# Altium schematic sheet lan8710_board.SchDoc: Наименование
size 420 x 297 mm; ApprovedBy: Утвердил; CheckedBy: Проверил; Author: Разработал; CompanyName: Организация; SheetNumber: 1; SheetTotal: 1; PageSetup: Record=PageOptions|CenterHorizontal=True|CenterVertical=True|PrintScale=0.94|XCorrection=1.00|YCorrection=1.00|PrintKind=1|BorderSize=5000000|LeftOffset=0|BottomOffset=0|Orientation=1|PaperLength=1000|PaperWidth=1000|Scale=100|PaperSource=7|PrintQuality=-4|MediaType=1|DitherType=10|PaperKind=A4|PrintScaleMode=1; HeadOfSector: Нач. сектора; MainDevice: Перв.примен.; Name1: Наименование1; n_kontr: Н. Контр; t_kontr: Т. Контр; lit_A: О; Name2: Наименование2; DocumentName: Sheet1.SCHDOC
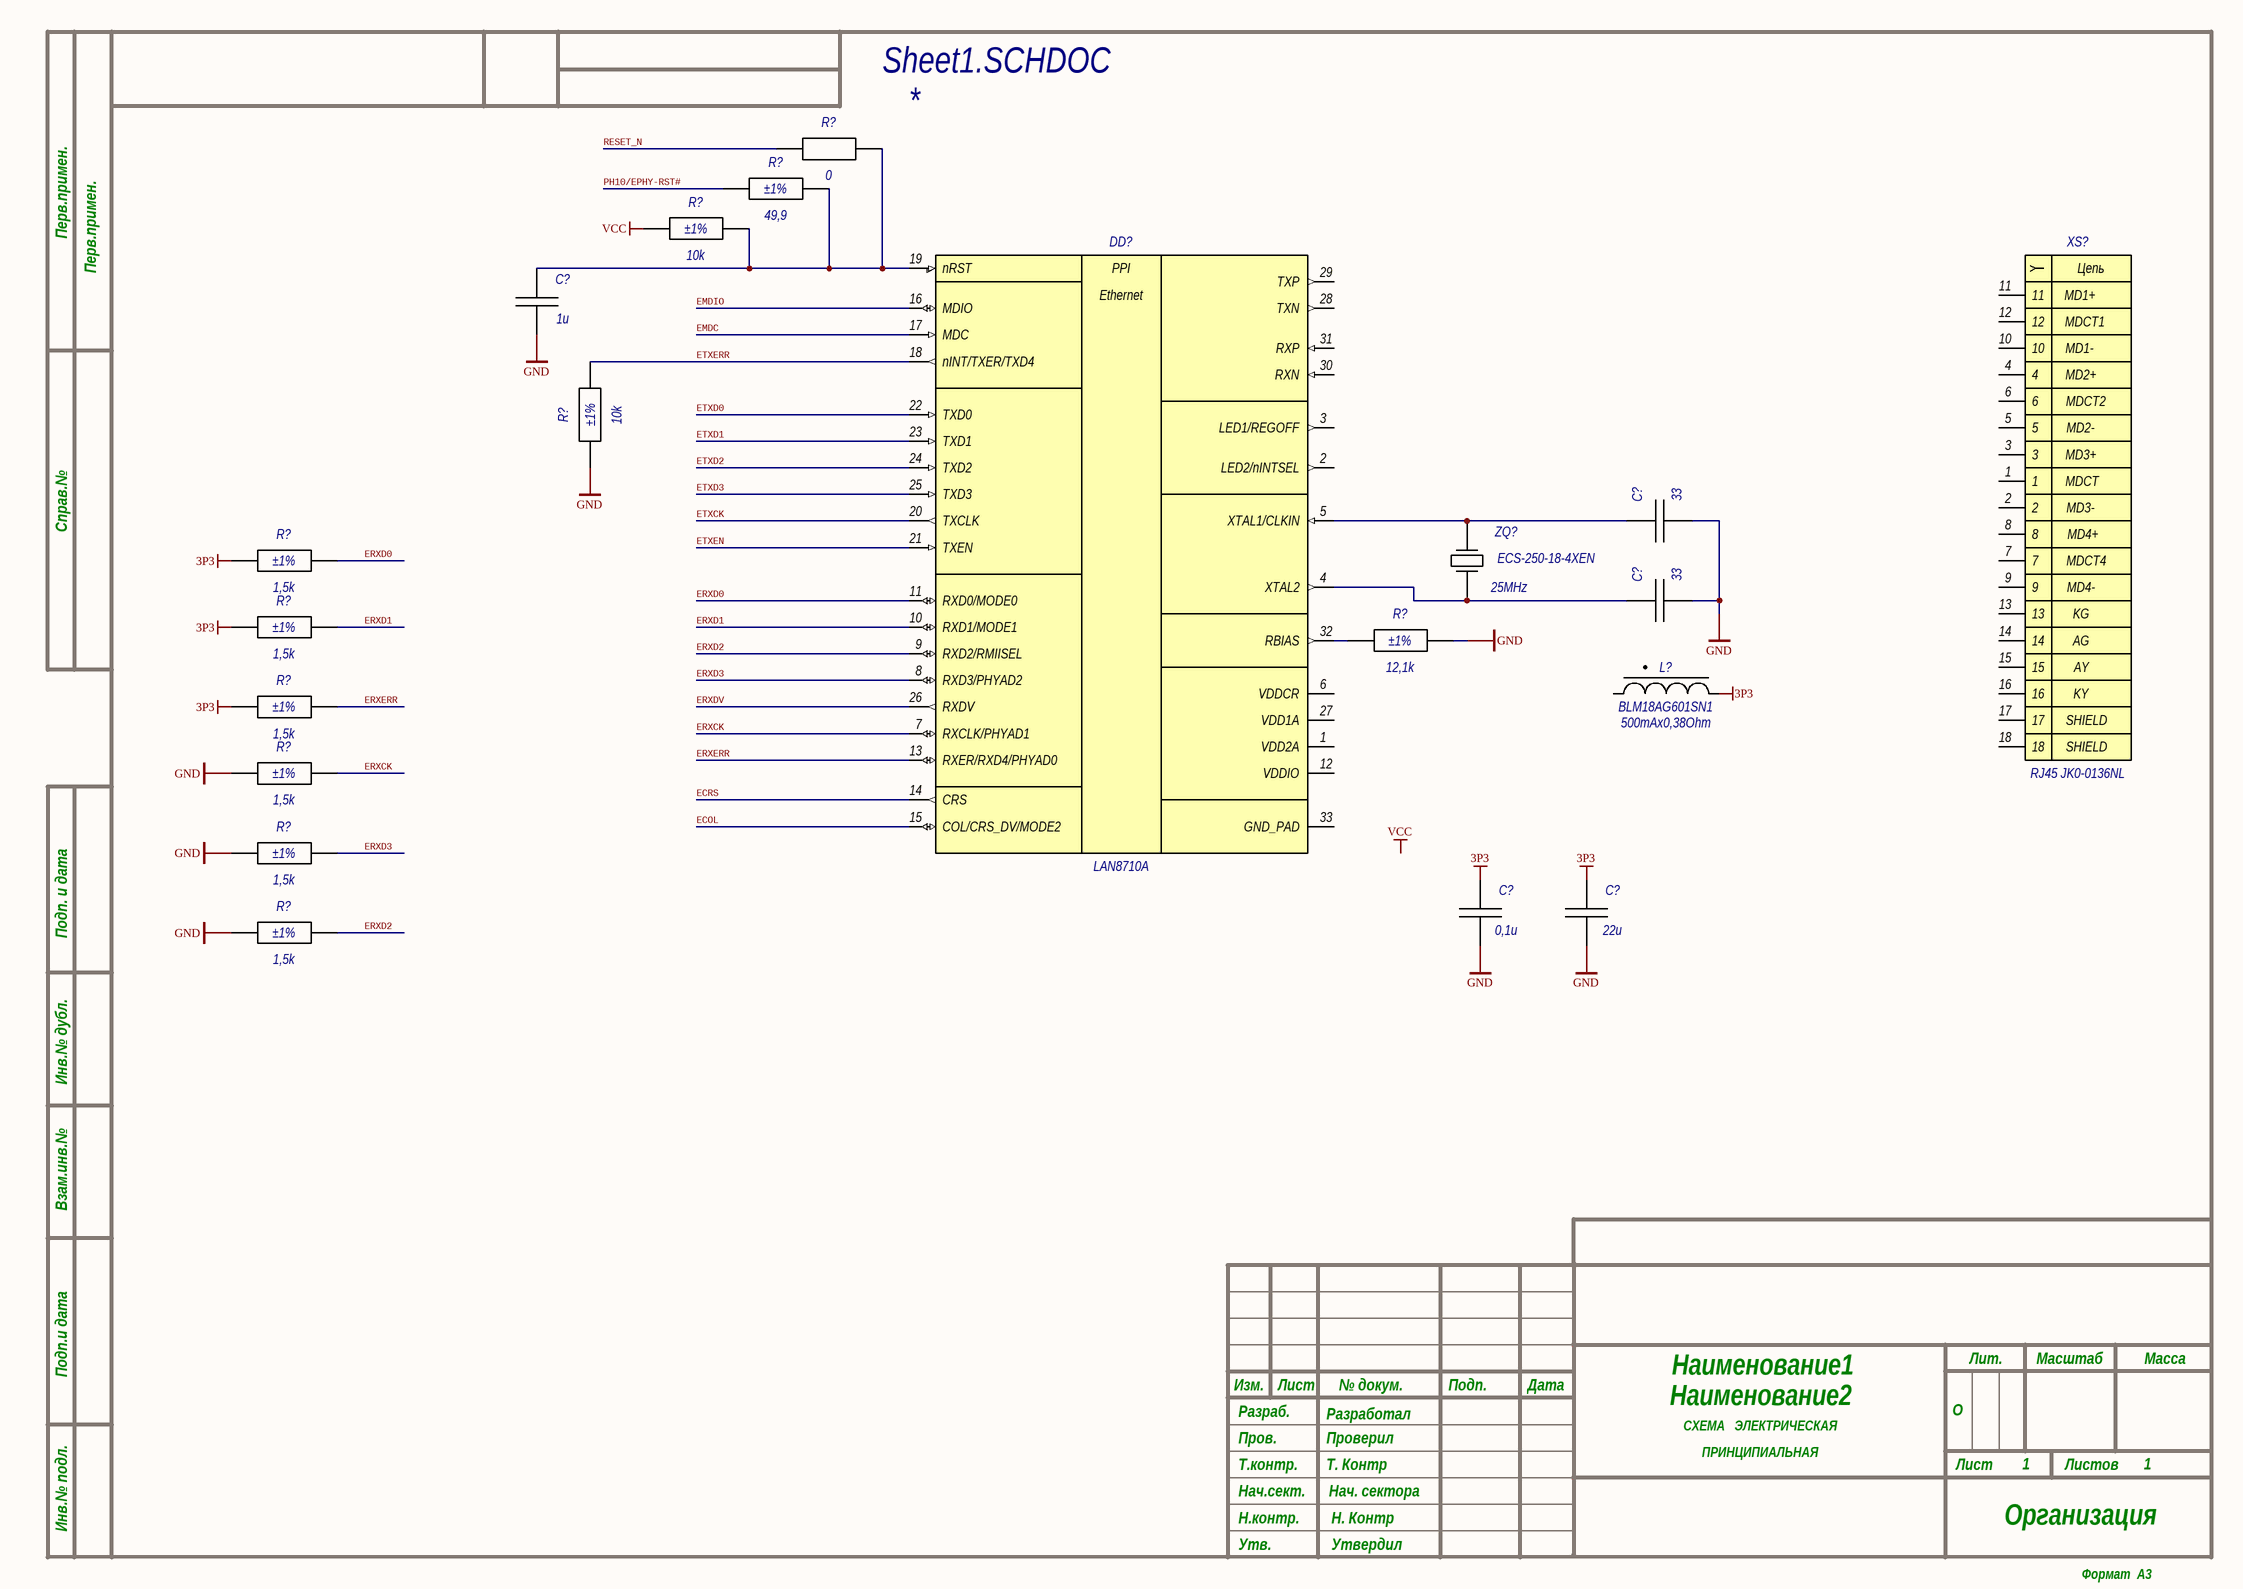
[diagram p0: lan8710_board.SchDoc]

## Parts
(Parts that share a designator on the sheet are numbered #1, #2 ... from top to bottom, then left to right.)
C?#1  1u  [C0603 HD]
C?#2  33  [C0603 HD]
C?#3  33  [C0603 HD]
C?#4  0,1u  [C0603 HD]
C?#5  22u  [C1206 HD]
DD?  LAN8710A  [QFN-32 LAN8710A MD]
L?  SchematicAdditionalParameter1: 500mAx0,38Ohm  [L0603 BLM18A (Murata) HD]  (hidden comment: BLM18AG601SN1)
R?#1  0  [R0603 0 5% HD]
R?#2  SchematicAdditionalParameter1: ±1%  [R0603 1% HD]  (hidden comment: 49,9)
R?#3  SchematicAdditionalParameter1: ±1%  [R0603 10k 1% HD]  (hidden comment: 10k)
R?#4  SchematicAdditionalParameter1: ±1%  [R0603 10k 1% HD]  (hidden comment: 10k)
R?#5  SchematicAdditionalParameter1: ±1%  [R0603 1.5k 1% HD]  (hidden comment: 1,5k)
R?#6  SchematicAdditionalParameter1: ±1%  [R0603 1.5k 1% HD]  (hidden comment: 1,5k)
R?#7  SchematicAdditionalParameter1: ±1%  [R0603 12.1k 1% HD]  (hidden comment: 12,1k)
R?#8  SchematicAdditionalParameter1: ±1%  [R0603 1.5k 1% HD]  (hidden comment: 1,5k)
R?#9  SchematicAdditionalParameter1: ±1%  [R0603 1.5k 1% HD]  (hidden comment: 1,5k)
R?#10  SchematicAdditionalParameter1: ±1%  [R0603 1.5k 1% HD]  (hidden comment: 1,5k)
R?#11  SchematicAdditionalParameter1: ±1%  [R0603 1.5k 1% HD]  (hidden comment: 1,5k)
XS?  RJ45 JK0-0136NL  [RJ45 JK0-0136NL (Pulse)]
ZQ?  SchematicAdditionalParameter2: 25MHz  [ECS-250-18-4XEN (ECS Inc)]  (hidden comment: ECS-250-18-4XEN)

## Nets
3P3: C?#4.1 C?#5.1 L?.2 R?#5.1 R?#6.1 R?#8.1
GND: C?#1.2 C?#2.2 C?#3.2 C?#4.2 C?#5.2 R?#4.1 R?#7.2 R?#9.1 R?#10.1 R?#11.1
VCC: R?#3.1
ECOL: DD?.15(COL/CRS_DV/MODE2)
ECRS: DD?.14(CRS)
EMDC: DD?.17(MDC)
EMDIO: DD?.16(MDIO)
ERXCK: DD?.7(RXCLK/PHYAD1) R?#9.2
ERXD0: DD?.11(RXD0/MODE0) R?#5.2
ERXD1: DD?.10(RXD1/MODE1) R?#6.2
ERXD2: DD?.9(RXD2/RMIISEL) R?#11.2
ERXD3: DD?.8(RXD3/PHYAD2) R?#10.2
ERXDV: DD?.26(RXDV)
ERXERR: DD?.13(RXER/RXD4/PHYAD0) R?#8.2
ETXCK: DD?.20(TXCLK)
ETXD0: DD?.22(TXD0)
ETXD1: DD?.23(TXD1)
ETXD2: DD?.24(TXD2)
ETXD3: DD?.25(TXD3)
ETXEN: DD?.21(TXEN)
ETXERR: DD?.18(nINT/TXER/TXD4) R?#4.2
PH10/EPHY-RST#: R?#2.1
RESET_N: R?#1.1
NetC?#1_1: C?#1.1 DD?.19(nRST) R?#1.2 R?#2.2 R?#3.2
NetC?#2_1: C?#2.1 DD?.5(XTAL1/CLKIN) ZQ?.2
NetC?#3_1: C?#3.1 DD?.4(XTAL2) ZQ?.1
NetDD?_32: DD?.32(RBIAS) R?#7.1

Not connected (* = marked no-connect by the designer): DD? 1(VDD2A) 2(LED2/nINTSEL) 3(LED1/REGOFF) 6(VDDCR) 12(VDDIO) 27(VDD1A) 28(TXN) 29(TXP) 30(RXN) 31(RXP) 33(GND_PAD); L? 1; XS? 1 2 3 4 5 6 7 8 9 10 11 12 13 14 15 16 17 18

## Notes on the sheet
- Labels drawn without touching a wire or pin: VCC
- Перв.примен.
- Справ.№
- Подп. и дата
- Инв.№ дубл.
- Взам.инв.№
- Подп.и дата
- Разраб.
- Изм.
- Лист
- № докум.
- Подп.
- Дата
- Лит.
- Масштаб
- Масса
- Т.контр.
- Пров.
- СХЕМА   ЭЛЕКТРИЧЕСКАЯ
- ПРИНЦИПИАЛЬНАЯ
- Листов
- Инв.№ подл.
- Утв.
- Н.контр.
- Нач.сект.
- Формат  A3
- (in symbol LAN8710A-EZC-ABC QFP-32 MIcrochip) PPI; Ethernet
- (in symbol RJ45 JK0-0136NL PulseJack) Цепь; MD1+; MDCT1; MD1-; MD2+; MDCT2; MD2-; MD3+; MDCT; MD3-; MD4+; MDCT4; MD4-; KG; AG; AY; KY; SHIELD

## Library data of the parts
C?#1 = 0603 1uF ±10% 25V X7R Murata: Chip MultiLayer Ceramic Capasitor 0603 Murata; OperationTemperatureRange: -55°C to +125°C; PackageTopMarking: NoMarking; OrderingCode: GRM188R71E105KA12; Denomination: 0603 1мкФ±10%, 25В, X7R; ComponentGroup: Capacitor; SchematicAdditionalParameter2: 25V; SchematicAdditionalParameter1: ±10%; SchematicAdditionalParameter3: X7R; ComponentLink1Description: DataSheet; ComponentLink2Description: Manufactured; ComponentLink1URL: D:\Libraries\DataSheets\GRM188R71E105KA12.pdf; ComponentLink2URL: http://www.murata.com; ComponentType: Ceramic Capacitor; Manufactured: Murata; PackageReference: 0603; CommentPCB: 1u; SchematicMainParameter: 1u
C?#2 C?#3 = 0603 33pF ±5% 50V COG Murata: Chip MultiLayer Ceramic Capasitor 0603 Murata; OperationTemperatureRange: -55°C to +125°C; PackageTopMarking: NoMarking; OrderingCode: GRM1885C1H330JA01; Denomination: 0603 33пФ±5%, 50В, COG; ComponentGroup: Capacitor; SchematicAdditionalParameter2: 50V; SchematicAdditionalParameter1: ±5%; SchematicAdditionalParameter3: COG; ComponentLink1Description: DataSheet; ComponentLink2Description: Manufactured; ComponentLink1URL: D:\Libraries\DataSheets\GRM1885C1H330JA01.pdf; ComponentLink2URL: http://www.murata.com; ComponentType: Ceramic Capacitor; Manufactured: Murata; PackageReference: 0603; CommentPCB: 33; SchematicMainParameter: 33
C?#4 = 0603 0.1uF ±10% 50V X7R Murata: Chip MultiLayer Ceramic Capasitor 0603 Murata; OperationTemperatureRange: -55°C to +125°C; PackageTopMarking: NoMarking; OrderingCode: GRM188R71H104KA93; Denomination: 0603 0,1мкФ±10%, 50В, X7R; ComponentGroup: Capacitor; SchematicAdditionalParameter2: 50V; SchematicAdditionalParameter1: ±10%; SchematicAdditionalParameter3: X7R; ComponentLink1Description: DataSheet; ComponentLink2Description: Manufactured; ComponentLink1URL: D:\Libraries\DataSheets\GRM188R71H104KA93.pdf; ComponentLink2URL: http://www.murata.com; ComponentType: Ceramic Capacitor; Manufactured: Murata; PackageReference: 0603; CommentPCB: 0,1u; SchematicMainParameter: 0,1u
C?#5 = 1206 22uF ±10% 25V X5R AVX: Chip MultiLayer Ceramic Capasitor 1206 AVX; Manufactured: Murata; OperationTemperatureRange: -55°C to +85°C; PackageTopMarking: NoMarking; OrderingCode: 12063D226KAT2A; Denomination: 1206 22мкФ±10%, 25В, X5R; ComponentGroup: Capacitor; SchematicAdditionalParameter2: 25V; SchematicAdditionalParameter1: ±10%; SchematicAdditionalParameter3: X5R; ComponentLink1Description: DataSheet; ComponentLink2Description: Manufactured; ComponentLink1URL: D:\Libraries\DataSheets\GRM31CR61E106KA12.pdf; ComponentLink2URL: http://www.murata.com; ComponentType: Ceramic Capacitor; PackageReference: 1206; CommentPCB: 22u; SchematicMainParameter: 22u
DD? = LAN8710A-EZC-ABC QFP-32 MIcrochip: Ethernet ICs MII/RMII 10/100 Eth Ethernet Transceiver; Denomination: LAN8710A-EZC-ABC(QFP-32); OperationTemperatureRange: 0°C to +85°C; ComponentGroup: Микросхема; SchematicAdditionalParameter1: 1,08...3,6V; PackageReference: QFP-32; ComponentLink2Description: Manufactured; ComponentLink1Description: DataSheet; ComponentType: Преобразователь интерфейса Ethernet; Manufactured: Microchip; OrderingCode: LAN8710A-EZC-ABC; SchematicAdditionalParameter2: *; SchematicAdditionalParameter3: *; CommentPCB: LAN8710A; SchematicMainParameter: LAN8710A
L? = 0603 BLM18AG601SN1 500mA 0.38Ohm Murata: Chip Ferrite Bead 0603 Murata; OperationTemperatureRange: -55°C to +125°C; PackageTopMarking: NoMarking; Denomination: BLM18AG601SN1 500мА, 0,38Ом (0603); ComponentGroup: Катушка индуктивности; SchematicAdditionalParameter2: 600Ohm±25% at 100MHz/20°C; ComponentLink2URL: http://www.murata.com/; ComponentLink2Description: Manufactured; ComponentLink1Description: DataSheet; ComponentLink1URL: D:\Libraries\DataSheets\BLM18A.pdf; ComponentType: Катушка индуктивности ферритовая; PackageReference: 0603; Manufactured: Murata; OrderingCode: BLM18AG601SN1; CommentPCB: BLM18AG601SN1; SchematicAdditionalParameter3: *; SchematicMainParameter: BLM18AG601SN1
R?#1 = 0603 0 ±1% 100mW Yageo: Chip resistor 0603 Yageo; OperationTemperatureRange: -55°C to +155°C; OrderingCode: RC0603FR-070RL; Denomination: 0603 0 Ом±1%, 0,1Вт; SchematicAdditionalParameter1: ±1%; SchematicAdditionalParameter2: 100mW; ComponentLink1URL: D:\Libraries\DataSheets\PYu-RC0603_51_RoHS_L_4.pdf; ComponentLink1Description: DataSheet; ComponentLink2URL: http://www.yageo.com/; ComponentLink2Description: Manufactured; ComponentType: Chip Resistor; PackageReference: 0603; Manufactured: Yageo; PackageTopMarking: 0; ComponentGroup: Resistor; SchematicAdditionalParameter3: *; CommentPCB: 0; SchematicMainParameter: 0
R?#2 = 0603 49.9 ±1% 100mW Yageo: Chip resistor 0603 Yageo; OperationTemperatureRange: -55°C to +155°C; OrderingCode: RC0603FR-0749R9L; Denomination: 0603 49,9Ом±1%, 0,1Вт; SchematicAdditionalParameter2: 100mW; ComponentLink1URL: D:\Libraries\DataSheets\PYu-RC0603_51_RoHS_L_4.pdf; ComponentLink1Description: DataSheet; ComponentLink2URL: http://www.yageo.com/; ComponentLink2Description: Manufactured; ComponentType: Chip Resistor; PackageReference: 0603; Manufactured: Yageo; ComponentGroup: Resistor; SchematicAdditionalParameter3: *; CommentPCB: 49,9; SchematicMainParameter: 49,9
R?#3 R?#4 = 0603 10k ±1% 100mW Yageo: Chip resistor 0603 Yageo; OperationTemperatureRange: -55°C to +155°C; PackageTopMarking: 103; OrderingCode: RC0603FR-0710KL; Denomination: 0603 10кОм±1%, 0,1Вт; SchematicAdditionalParameter2: 100mW; ComponentLink1URL: D:\Libraries\DataSheets\PYu-RC0603_51_RoHS_L_4.pdf; ComponentLink1Description: DataSheet; ComponentLink2URL: http://www.yageo.com/; ComponentLink2Description: Manufactured; ComponentType: Chip Resistor; PackageReference: 0603; Manufactured: Yageo; ComponentGroup: Resistor; SchematicAdditionalParameter3: *; CommentPCB: 10k; SchematicMainParameter: 10k
R?#5 R?#6 R?#8-R?#11 = 0603 1.5k ±1% 100mW Yageo: Chip resistor 0603 Yageo; OperationTemperatureRange: -55°C to +155°C; PackageTopMarking: 152; OrderingCode: RC0603FR-071K5L; Denomination: 0603 1,5кОм±1%, 0,1Вт; SchematicAdditionalParameter2: 100mW; ComponentLink1URL: D:\Libraries\DataSheets\PYu-RC0603_51_RoHS_L_4.pdf; ComponentLink1Description: DataSheet; ComponentLink2URL: http://www.yageo.com/; ComponentLink2Description: Manufactured; ComponentType: Chip Resistor; PackageReference: 0603; Manufactured: Yageo; ComponentGroup: Resistor; SchematicAdditionalParameter3: *; CommentPCB: 1,5k; SchematicMainParameter: 1,5k
R?#7 = 0603 12.1k ±1% 100mW Yageo: Chip resistor 0603 Yageo; OperationTemperatureRange: -55°C to +155°C; PackageTopMarking: 09C; OrderingCode: RC0603FR-0712K1L; Denomination: 0603 12,1кОм±1%, 0,1Вт; SchematicAdditionalParameter2: 100mW; ComponentLink1URL: D:\Libraries\DataSheets\PYu-RC0603_51_RoHS_L_v5.pdf; ComponentLink1Description: DataSheet; ComponentLink2URL: http://www.yageo.com/; ComponentLink2Description: Manufactured; ComponentType: Chip Resistor; PackageReference: 0603; Manufactured: Yageo; ComponentGroup: Resistor; SchematicAdditionalParameter3: *; CommentPCB: 12,1k; SchematicMainParameter: 12,1k
XS? = RJ45 JK0-0136NL PulseJack: CONN MAGJACK 1 PORT 1000 BASE-T; Manufactured: Pulse; OperationTemperatureRange: 0°С to +70°C; PackageTopMarking: NoMarking; Denomination: JK0-0136NL (RJ45); ComponentGroup: Соединители контактные; SchematicAdditionalParameter1: 150V; SchematicAdditionalParameter2: 1,5A; SchematicAdditionalParameter3: 0,2Ohm; PackageReference: RJ45; ComponentLink1Description: DataSheet; ComponentLink3Description: Manufactured; ComponentType: Розетка; OrderingCode: JK0-0136NL; CommentPCB: RJ45 JK0-0136NL; ComponentLink2Description: Drawing; SchematicMainParameter: RJ45 JK0-0136NL
ZQ? = ECS-250-18-4XEN HC49/US 25MHz ±30ppm ECS Inc: Quartz Crystal 25MHz ECS Inc; Manufactured: ECS Inc; OperationTemperatureRange: -40°C to +85°C; PackageTopMarking: 25.000; ComponentGroup: Резонатор кварцевый; Denomination: ECS-250-18-4XEN 25МГц±30ppm, 18пФ; SchematicAdditionalParameter1: ±30ppm; SchematicAdditionalParameter3: 18pF; ComponentLink2URL: http://www.ecsxtal.com/; ComponentLink2Description: Manufactured; ComponentLink1Description: DataSheet; ComponentLink1URL: D:\Libraries\DataSheets\HC-49USX.pdf; ComponentType: Резонатор кварцевый; PackageReference: HC49/US; OrderingCode: ECS-250-18-4XEN; CommentPCB: ECS-250-18-4XEN; SchematicMainParameter: ECS-250-18-4XEN